# Altium schematic sheet Module Connector Female.SchDoc: Module Connector Female
size B; SheetNumber: 11; SheetTotal: 14
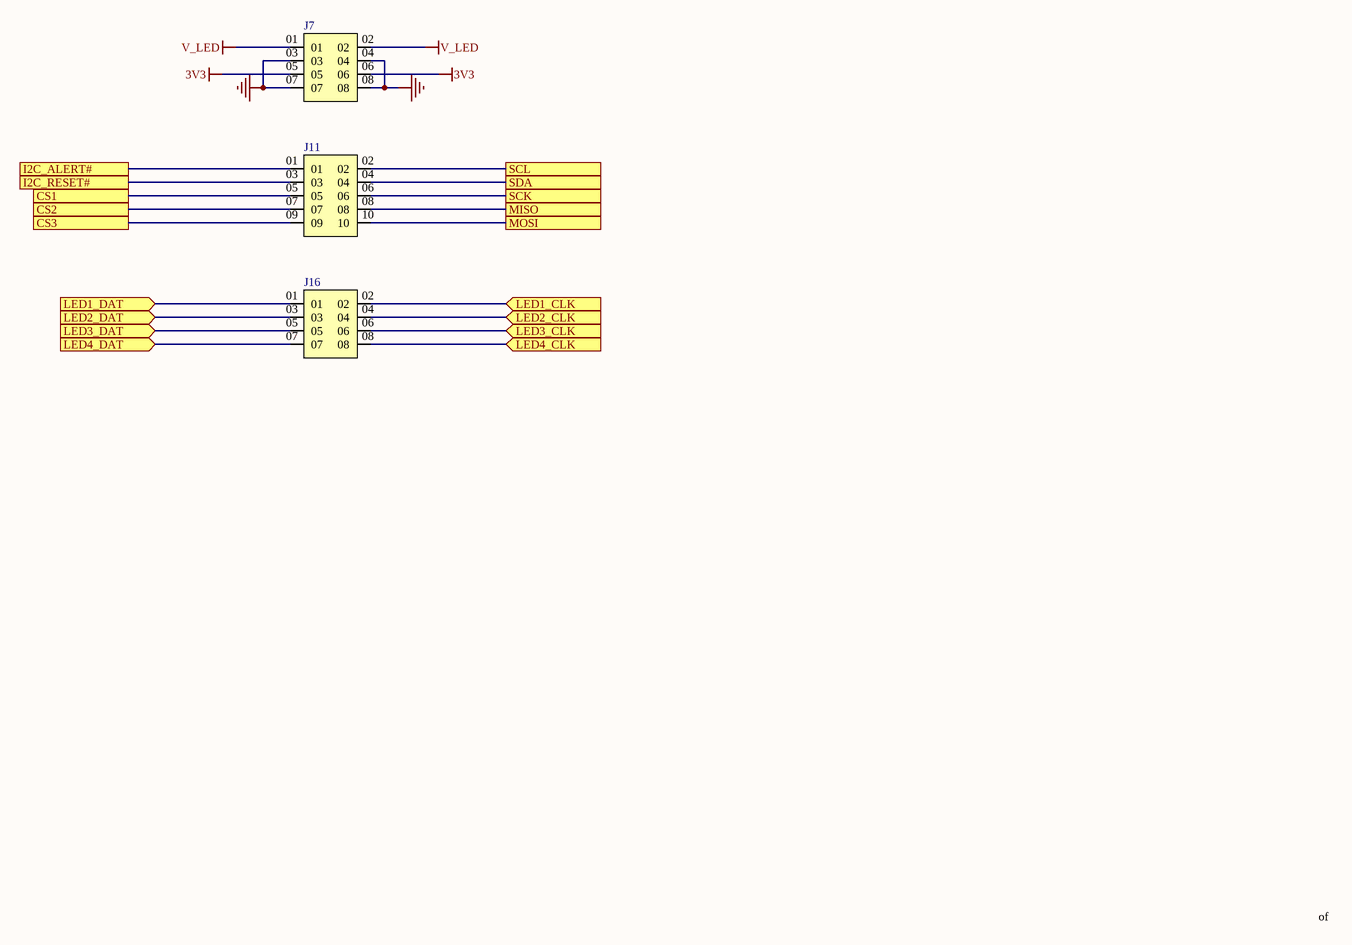
[diagram p0: Module Connector Female.SchDoc]

## Parts
J7  Socket 4x2 0.1" RA  [Socket 4x2 0.1" RA]  (value not drawn)
J11  Socket 5x2 0.1" RA  [Socket 5x2 0.1" RA Through Hole]  (value not drawn)
J16  Socket 4x2 0.1" RA  [Socket 4x2 0.1" RA]  (value not drawn)

## Ports
CS1, CS2, CS3, I2C_ALERT#, I2C_RESET#, LED1_CLK (in), LED1_DAT (in), LED2_CLK (in), LED2_DAT (in), LED3_CLK (in), LED3_DAT (in), LED4_CLK (in), LED4_DAT (in), MISO, MOSI, SCK, SCL, SDA

## Nets
3V3: J7.05 J7.06
GND: J7.03 J7.04 J7.07 J7.08
V_LED: J7.01 J7.02
CS1: J11.05 ; port CS1
CS2: J11.07 ; port CS2
CS3: J11.09 ; port CS3
I2C_ALERT#: J11.01 ; port I2C_ALERT#
I2C_RESET#: J11.03 ; port I2C_RESET#
LED1_CLK: J16.02 ; port LED1_CLK
LED1_DAT: J16.01 ; port LED1_DAT
LED2_CLK: J16.04 ; port LED2_CLK
LED2_DAT: J16.03 ; port LED2_DAT
LED3_CLK: J16.06 ; port LED3_CLK
LED3_DAT: J16.05 ; port LED3_DAT
LED4_CLK: J16.08 ; port LED4_CLK
LED4_DAT: J16.07 ; port LED4_DAT
MISO: J11.08 ; port MISO
MOSI: J11.10 ; port MOSI
SCK: J11.06 ; port SCK
SCL: J11.02 ; port SCL
SDA: J11.04 ; port SDA

## Notes on the sheet
- of

## Library data of the parts
J7 J16 = CMP-002-00225-3: Board Connector, 8 Contact(s), 2 Row(s), Female, Right Angle, 0.1 inch Pitch, Solder Terminal, Black Insulator, Socket; Max Current Rating: 3A; Min Operating Temperature: -65°C; Connector Type: BOARD CONNECTOR; RoHS Compliant: Yes; Pins: 8; Mounting Technology: Board; Max Operating Temperature: 105°C; Gender: Female
J11 = CMP-002-00229-3: Board Connector, 10 Contact(s), 2 Row(s), Female, Right Angle, 0.1 inch Pitch, Solder Terminal, Black Insulator, Socket; Max Current Rating: 3A; Gender: Female; Connector Type: BOARD CONNECTOR; Min Operating Temperature: -65°C; Pins: 10; Max Operating Temperature: 105°C; RoHS Compliant: Yes; Mounting Technology: Through Hole